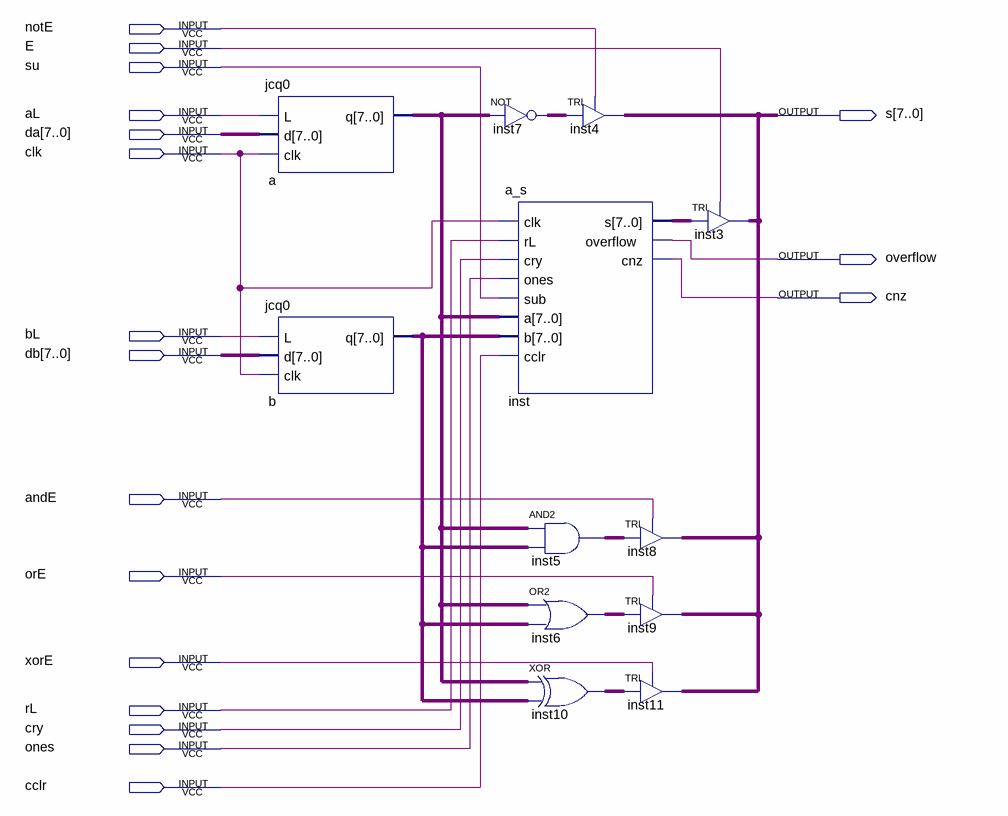
[diagram p0: schematic sheet]
// Quartus schematic alu.bdf as structural Verilog: 12 symbols, 18 pins
module alu (
  input  notE,
  input  E,
  input  su,
  input  aL,
  input  [7:0] da,
  input  clk,
  input  bL,
  input  [7:0] db,
  input  andE,
  input  orE,
  input  xorE,
  input  rL,
  input  cry,
  input  ones,
  input  cclr,
  output [7:0] s,
  output overflow,
  output cnz
);

  wire [7:0] a_q, b_q, inst5_out, inst6_out, inst7_out, inst10_out, inst_s;

  jcq0 a (.L(aL), .d(da), .clk(clk), .q(a_q));
  jcq0 b (.L(bL), .d(db), .clk(clk), .q(b_q));
  assign inst7_out = ~a_q;  // NOT inst7, 8 bits wide
  a_s inst (
    .clk(clk), .rL(rL), .cry(cry), .ones(ones), .sub(su), .a(a_q), .b(b_q), .cclr(cclr), .s(inst_s),
    .overflow(overflow), .cnz(cnz));
  TRI inst4[7:0] (.IN(inst7_out), .OE(notE), .OUT(s));
  assign inst5_out = a_q & b_q;  // AND2 inst5, 8 bits wide
  assign inst6_out = a_q | b_q;  // OR2 inst6, 8 bits wide
  assign inst10_out = a_q ^ b_q;  // XOR inst10, 8 bits wide
  TRI inst8[7:0] (.IN(inst5_out), .OE(andE), .OUT(s));
  TRI inst9[7:0] (.IN(inst6_out), .OE(orE), .OUT(s));
  TRI inst11[7:0] (.IN(inst10_out), .OE(xorE), .OUT(s));
  TRI inst3[7:0] (.IN(inst_s), .OE(E), .OUT(s));
endmodule
